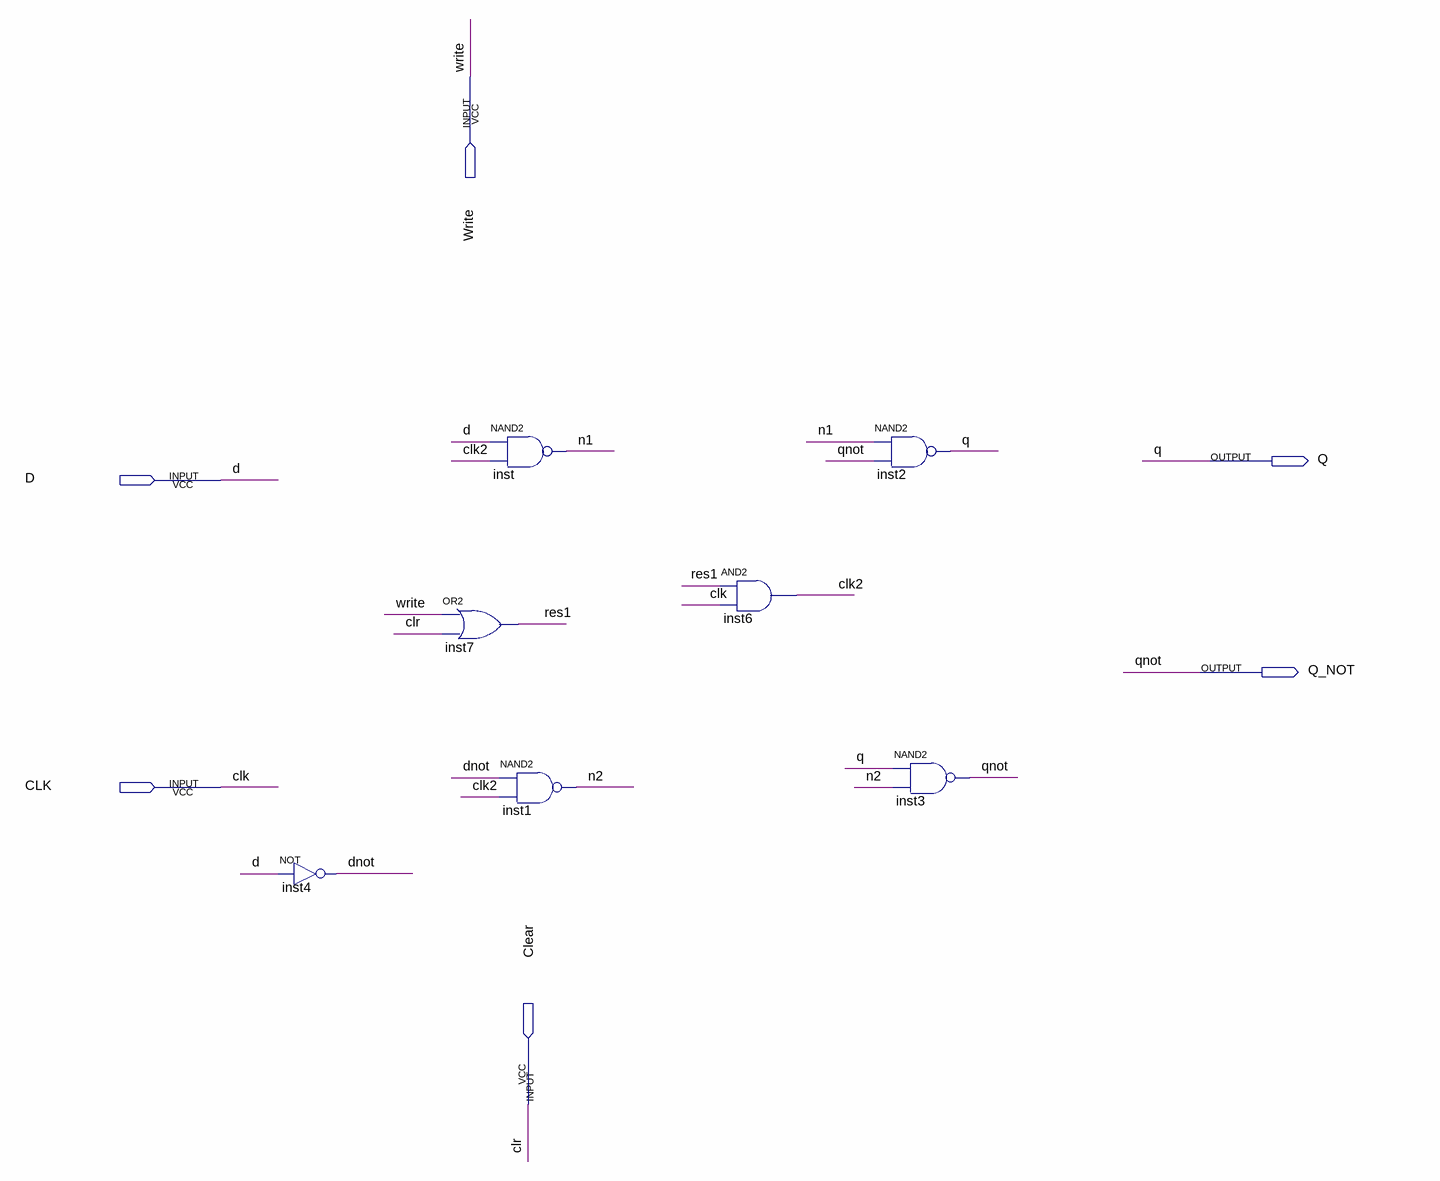
[diagram p0: schematic sheet]
// Quartus schematic mydff.bdf as structural Verilog: 7 symbols, 6 pins
module mydff (
  input  Write,
  input  D,
  input  CLK,
  input  Clear,
  output Q,
  output Q_NOT
);

  wire clk2, dnot, n1, n2, res1;

  not inst4 (dnot, D);
  or inst7 (res1, Write, Clear);
  nand inst (n1, D, clk2);
  nand inst1 (n2, dnot, clk2);
  and inst6 (clk2, res1, CLK);
  nand inst2 (Q, n1, Q_NOT);
  nand inst3 (Q_NOT, Q, n2);

  // Other names for the same wires on the sheet: clr = Clear; qnot = Q_NOT
endmodule
